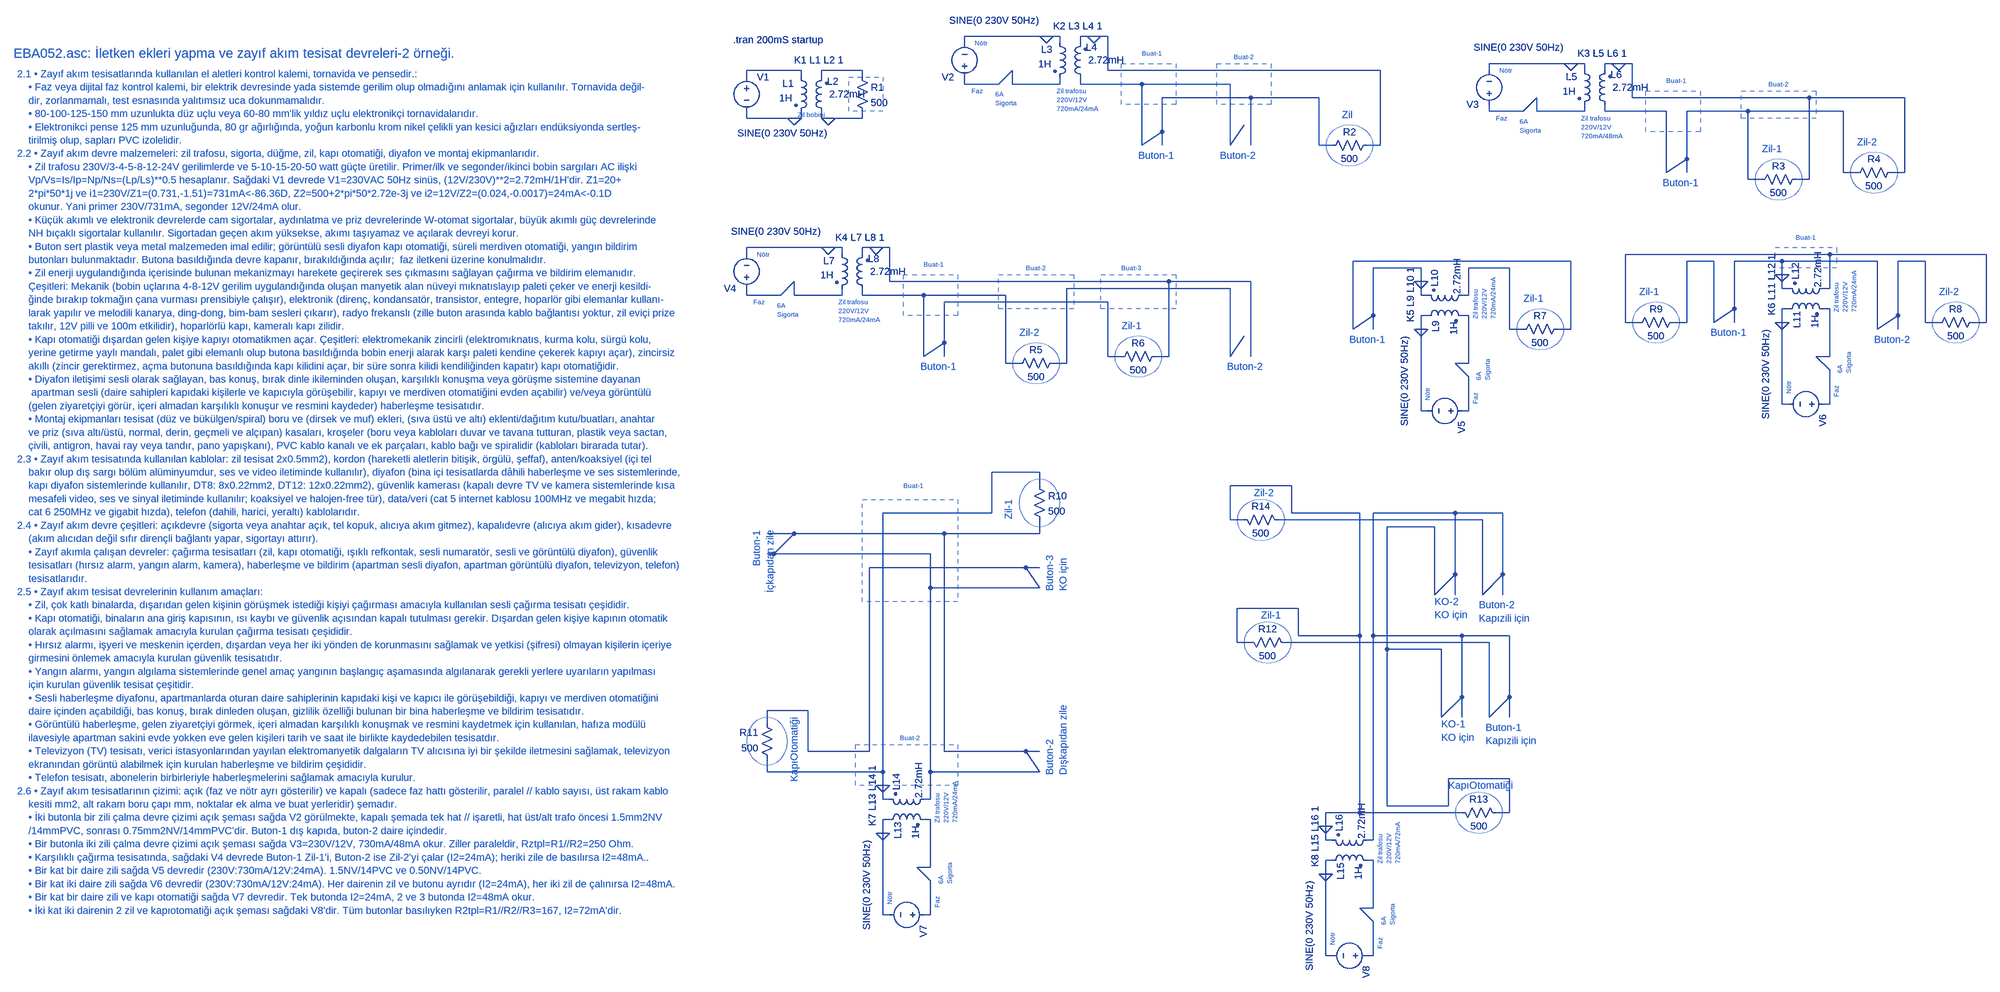
[diagram p0: schematic EBA052.asc]
EBA052.asc, the LTspice schematic file:
Version 4
SHEET 1 6276 2612
WIRE 2512 0 2320 0
WIRE 2544 0 2512 0
WIRE 2624 0 2592 0
WIRE 2656 0 2624 0
WIRE 2320 16 2320 0
WIRE 2544 16 2544 0
WIRE 2592 16 2592 0
WIRE 3744 64 3552 64
WIRE 3776 64 3744 64
WIRE 3856 64 3824 64
WIRE 3888 64 3856 64
WIRE 1936 80 1808 80
WIRE 2080 80 1984 80
WIRE 2656 80 2656 0
WIRE 3296 80 2656 80
WIRE 3552 80 3552 64
WIRE 3776 80 3776 64
WIRE 3824 80 3824 64
WIRE 1808 96 1808 80
WIRE 1936 96 1936 80
WIRE 1984 96 1984 80
WIRE 2080 96 2080 80
WIRE 2320 112 2320 96
WIRE 2400 112 2432 80
WIRE 2400 112 2320 112
WIRE 2432 112 2432 80
WIRE 2544 112 2544 96
WIRE 2544 112 2432 112
WIRE 2592 112 2592 96
WIRE 2736 112 2592 112
WIRE 2944 112 2736 112
WIRE 2992 144 2784 144
WIRE 3152 144 2992 144
WIRE 3888 144 3888 64
WIRE 4304 144 3888 144
WIRE 4528 144 4304 144
WIRE 3552 176 3552 160
WIRE 3632 176 3664 144
WIRE 3632 176 3552 176
WIRE 3664 176 3664 144
WIRE 3776 176 3776 160
WIRE 3776 176 3664 176
WIRE 3824 176 3824 160
WIRE 3968 176 3824 176
WIRE 4160 176 4016 176
WIRE 4384 176 4160 176
WIRE 1808 192 1808 176
WIRE 1920 192 1808 192
WIRE 1936 192 1936 176
WIRE 1936 192 1920 192
WIRE 1984 192 1984 176
WIRE 2000 192 1984 192
WIRE 2080 192 2080 176
WIRE 2080 192 2000 192
WIRE 2784 224 2784 144
WIRE 2736 256 2736 112
WIRE 2736 256 2784 224
WIRE 2784 256 2784 224
WIRE 2944 256 2944 112
WIRE 2944 256 2976 208
WIRE 2992 256 2992 144
WIRE 3152 256 3152 144
WIRE 3184 256 3152 256
WIRE 3296 256 3296 80
WIRE 3296 256 3264 256
WIRE 4016 288 4016 176
WIRE 3968 320 3968 176
WIRE 3968 320 4016 288
WIRE 4016 320 4016 288
WIRE 4384 320 4384 176
WIRE 4416 320 4384 320
WIRE 4528 320 4528 144
WIRE 4528 320 4496 320
WIRE 4160 336 4160 176
WIRE 4192 336 4160 336
WIRE 4304 336 4304 144
WIRE 4304 336 4272 336
WIRE 2000 496 1808 496
WIRE 2032 496 2000 496
WIRE 2112 496 2080 496
WIRE 2144 496 2112 496
WIRE 1808 512 1808 496
WIRE 2032 512 2032 496
WIRE 2080 512 2080 496
WIRE 4352 512 3872 512
WIRE 4720 512 4352 512
WIRE 3744 528 3232 528
WIRE 4080 528 4016 528
WIRE 4240 528 4128 528
WIRE 4464 528 4240 528
WIRE 4576 528 4512 528
WIRE 3392 544 3280 544
WIRE 3600 544 3504 544
WIRE 4240 560 4240 528
WIRE 2144 576 2144 496
WIRE 2800 576 2144 576
WIRE 2992 576 2800 576
WIRE 3392 576 3392 544
WIRE 2944 592 2560 592
WIRE 4240 592 4240 560
WIRE 4256 592 4240 592
WIRE 4352 592 4352 512
WIRE 4352 592 4336 592
WIRE 1808 608 1808 592
WIRE 1888 608 1920 576
WIRE 1888 608 1808 608
WIRE 1920 608 1920 576
WIRE 2032 608 2032 592
WIRE 2032 608 1920 608
WIRE 2080 608 2080 592
WIRE 2224 608 2080 608
WIRE 2416 608 2224 608
WIRE 3392 608 3392 576
WIRE 3408 608 3392 608
WIRE 3504 608 3504 544
WIRE 3504 608 3488 608
WIRE 2656 624 2272 624
WIRE 4128 640 4128 528
WIRE 4256 640 4240 640
WIRE 4352 640 4336 640
WIRE 3280 656 3280 544
WIRE 3408 656 3392 656
WIRE 3504 656 3488 656
WIRE 4512 656 4512 528
WIRE 3872 672 3872 512
WIRE 3904 672 3872 672
WIRE 4016 672 4016 528
WIRE 4016 672 3984 672
WIRE 4080 672 4080 528
WIRE 4080 672 4128 640
WIRE 4128 672 4128 640
WIRE 4240 672 4240 640
WIRE 4576 672 4576 528
WIRE 4608 672 4576 672
WIRE 4720 672 4720 512
WIRE 4720 672 4688 672
WIRE 3232 688 3232 528
WIRE 3232 688 3280 656
WIRE 3280 688 3280 656
WIRE 3392 688 3392 656
WIRE 3600 688 3600 544
WIRE 3632 688 3600 688
WIRE 3744 688 3744 528
WIRE 3744 688 3712 688
WIRE 4464 688 4464 528
WIRE 4464 688 4512 656
WIRE 4512 688 4512 656
WIRE 2272 720 2272 624
WIRE 2224 752 2224 608
WIRE 2224 752 2272 720
WIRE 2272 752 2272 720
WIRE 2656 752 2656 624
WIRE 2688 752 2656 752
WIRE 2800 752 2800 576
WIRE 2800 752 2768 752
WIRE 2944 752 2944 592
WIRE 2944 752 2976 704
WIRE 2992 752 2992 576
WIRE 4352 752 4352 640
WIRE 4352 752 4320 752
WIRE 2416 768 2416 608
WIRE 2448 768 2416 768
WIRE 2560 768 2560 592
WIRE 2560 768 2528 768
WIRE 3504 768 3504 656
WIRE 3504 768 3472 768
WIRE 4352 784 4320 752
WIRE 3504 800 3472 768
WIRE 4240 864 4240 672
WIRE 4256 864 4240 864
WIRE 4352 864 4352 784
WIRE 4352 864 4336 864
WIRE 3392 880 3392 688
WIRE 3408 880 3392 880
WIRE 3504 880 3504 800
WIRE 3504 880 3488 880
WIRE 2496 1024 2384 1024
WIRE 2496 1056 2496 1024
WIRE 3088 1056 2944 1056
WIRE 2384 1120 2384 1024
WIRE 2384 1120 2128 1120
WIRE 3088 1120 3088 1056
WIRE 3248 1120 3088 1120
WIRE 3472 1120 3280 1120
WIRE 3584 1120 3472 1120
WIRE 2944 1136 2944 1056
WIRE 2976 1136 2944 1136
WIRE 3536 1136 3056 1136
WIRE 3424 1152 3312 1152
WIRE 1920 1168 1856 1168
WIRE 2272 1168 1920 1168
WIRE 2496 1168 2496 1136
WIRE 2496 1168 2272 1168
WIRE 1872 1216 1920 1168
WIRE 1872 1216 1856 1216
WIRE 2240 1216 1872 1216
WIRE 2464 1248 2096 1248
WIRE 2496 1248 2464 1248
WIRE 3472 1264 3472 1120
WIRE 3584 1264 3584 1120
WIRE 2240 1296 2240 1216
WIRE 2496 1296 2464 1248
WIRE 2496 1296 2240 1296
WIRE 3424 1312 3424 1152
WIRE 3424 1312 3472 1264
WIRE 3472 1312 3472 1264
WIRE 3536 1312 3536 1136
WIRE 3536 1312 3584 1264
WIRE 3584 1312 3584 1264
WIRE 3104 1344 2960 1344
WIRE 3104 1408 3104 1344
WIRE 3248 1408 3248 1120
WIRE 3248 1408 3104 1408
WIRE 3280 1408 3280 1120
WIRE 3488 1408 3280 1408
WIRE 3600 1408 3488 1408
WIRE 2960 1424 2960 1344
WIRE 2992 1424 2960 1424
WIRE 3552 1424 3072 1424
WIRE 3312 1440 3312 1152
WIRE 3440 1440 3312 1440
WIRE 3488 1552 3488 1408
WIRE 3600 1552 3600 1408
WIRE 1952 1584 1856 1584
WIRE 3440 1600 3440 1440
WIRE 3440 1600 3488 1552
WIRE 3488 1600 3488 1552
WIRE 3552 1600 3552 1424
WIRE 3552 1600 3600 1552
WIRE 3600 1600 3600 1552
WIRE 1856 1616 1856 1584
WIRE 1952 1680 1952 1584
WIRE 2096 1680 2096 1248
WIRE 2096 1680 1952 1680
WIRE 2272 1680 2272 1168
WIRE 2464 1680 2272 1680
WIRE 2496 1680 2464 1680
WIRE 1856 1728 1856 1696
WIRE 2128 1728 2128 1120
WIRE 2128 1728 1856 1728
WIRE 2240 1728 2240 1296
WIRE 2496 1728 2464 1680
WIRE 2496 1728 2240 1728
WIRE 3600 1744 3456 1744
WIRE 2128 1760 2128 1728
WIRE 2128 1792 2128 1760
WIRE 2144 1792 2128 1792
WIRE 2240 1792 2240 1728
WIRE 2240 1792 2224 1792
WIRE 3312 1808 3312 1440
WIRE 3456 1808 3456 1744
WIRE 3456 1808 3312 1808
WIRE 3248 1824 3248 1408
WIRE 3248 1824 3168 1824
WIRE 3488 1824 3248 1824
WIRE 3600 1824 3600 1744
WIRE 3600 1824 3568 1824
WIRE 2144 1840 2128 1840
WIRE 2240 1840 2224 1840
WIRE 3168 1856 3168 1824
WIRE 2128 1872 2128 1840
WIRE 3168 1888 3168 1856
WIRE 3184 1888 3168 1888
WIRE 3280 1888 3280 1408
WIRE 3280 1888 3264 1888
WIRE 3184 1936 3168 1936
WIRE 3280 1936 3264 1936
WIRE 2240 1952 2240 1840
WIRE 2240 1952 2208 1952
WIRE 3168 1968 3168 1936
WIRE 2240 1984 2208 1952
WIRE 3280 2048 3280 1936
WIRE 3280 2048 3248 2048
WIRE 2128 2064 2128 1872
WIRE 2144 2064 2128 2064
WIRE 2240 2064 2240 1984
WIRE 2240 2064 2224 2064
WIRE 3280 2080 3248 2048
WIRE 3168 2160 3168 1968
WIRE 3184 2160 3168 2160
WIRE 3280 2160 3280 2080
WIRE 3280 2160 3264 2160
FLAG 1920 192 0
FLAG 2000 192 0
FLAG 2512 0 0
FLAG 2624 0 0
FLAG 3744 64 0
FLAG 3856 64 0
FLAG 2000 496 0
FLAG 2112 496 0
FLAG 3392 688 0
FLAG 3392 576 0
FLAG 4240 672 0
FLAG 4240 560 0
FLAG 2128 1872 0
FLAG 2128 1760 0
FLAG 3168 1968 0
FLAG 3168 1856 0
SYMBOL voltage 1808 80 R0
WINDOW 3 -22 147 Left 2
WINDOW 123 0 0 Left 0
WINDOW 39 0 0 Left 0
SYMATTR Value SINE(0 230V 50Hz)
SYMATTR InstName V1
SYMBOL ind2 1920 80 R0
WINDOW 0 -28 31 Left 2
WINDOW 3 -35 65 Left 2
SYMATTR InstName L1
SYMATTR Value 1H
SYMATTR Type ind
SYMATTR SpiceLine Rser=20
SYMBOL ind2 2000 192 R180
WINDOW 0 -24 86 Left 2
WINDOW 3 -87 56 Left 2
SYMATTR InstName L2
SYMATTR Value 2.72mH
SYMATTR Type ind
SYMBOL res 2064 80 R0
SYMATTR InstName R1
SYMATTR Value 500
SYMBOL voltage 2320 112 R180
WINDOW 3 -175 150 Left 2
WINDOW 123 0 0 Left 0
WINDOW 39 0 0 Left 0
SYMATTR Value SINE(0 230V 50Hz)
SYMATTR InstName V2
SYMBOL ind2 2528 0 R0
WINDOW 0 -28 31 Left 2
WINDOW 3 -35 65 Left 2
SYMATTR InstName L3
SYMATTR Value 1H
SYMATTR Type ind
SYMATTR SpiceLine Rser=20
SYMBOL ind2 2608 112 R180
WINDOW 0 -24 86 Left 2
WINDOW 3 -87 56 Left 2
SYMATTR InstName L4
SYMATTR Value 2.72mH
SYMATTR Type ind
SYMBOL res 3280 240 R90
WINDOW 0 0 56 VBottom 2
WINDOW 3 32 56 VTop 2
SYMATTR InstName R2
SYMATTR Value 500
SYMBOL voltage 3552 176 R180
WINDOW 3 -175 150 Left 2
WINDOW 123 0 0 Left 0
WINDOW 39 0 0 Left 0
SYMATTR Value SINE(0 230V 50Hz)
SYMATTR InstName V3
SYMBOL ind2 3760 64 R0
WINDOW 0 -28 31 Left 2
WINDOW 3 -35 65 Left 2
SYMATTR InstName L5
SYMATTR Value 1H
SYMATTR Type ind
SYMATTR SpiceLine Rser=20
SYMBOL ind2 3840 176 R180
WINDOW 0 -24 86 Left 2
WINDOW 3 -87 56 Left 2
SYMATTR InstName L6
SYMATTR Value 2.72mH
SYMATTR Type ind
SYMBOL res 4512 304 R90
WINDOW 0 0 56 VBottom 2
WINDOW 3 32 56 VTop 2
SYMATTR InstName R4
SYMATTR Value 500
SYMBOL res 4288 320 R90
WINDOW 0 0 56 VBottom 2
WINDOW 3 32 56 VTop 2
SYMATTR InstName R3
SYMATTR Value 500
SYMBOL voltage 1808 608 R180
WINDOW 3 -175 150 Left 2
WINDOW 123 0 0 Left 0
WINDOW 39 0 0 Left 0
SYMATTR Value SINE(0 230V 50Hz)
SYMATTR InstName V4
SYMBOL ind2 2016 496 R0
WINDOW 0 -28 31 Left 2
WINDOW 3 -35 65 Left 2
SYMATTR InstName L7
SYMATTR Value 1H
SYMATTR Type ind
SYMATTR SpiceLine Rser=20
SYMBOL ind2 2096 608 R180
WINDOW 0 -24 86 Left 2
WINDOW 3 -87 56 Left 2
SYMATTR InstName L8
SYMATTR Value 2.72mH
SYMATTR Type ind
SYMBOL res 2784 736 R90
WINDOW 0 0 56 VBottom 2
WINDOW 3 32 56 VTop 2
SYMATTR InstName R6
SYMATTR Value 500
SYMBOL res 2544 752 R90
WINDOW 0 0 56 VBottom 2
WINDOW 3 32 56 VTop 2
SYMATTR InstName R5
SYMATTR Value 500
SYMBOL voltage 3504 880 R90
WINDOW 3 -175 150 Left 2
WINDOW 123 0 0 Left 0
WINDOW 39 0 0 Left 0
SYMATTR Value SINE(0 230V 50Hz)
SYMATTR InstName V5
SYMBOL ind2 3392 672 R270
WINDOW 0 -10 51 Bottom 2
WINDOW 3 -15 62 Top 2
SYMATTR InstName L9
SYMATTR Value 1H
SYMATTR Type ind
SYMATTR SpiceLine Rser=20
SYMBOL ind2 3504 592 R90
WINDOW 0 -24 64 Top 2
WINDOW 3 -28 43 Bottom 2
SYMATTR InstName L10
SYMATTR Value 2.72mH
SYMATTR Type ind
SYMBOL res 3728 672 R90
WINDOW 0 0 56 VBottom 2
WINDOW 3 32 56 VTop 2
SYMATTR InstName R7
SYMATTR Value 500
SYMBOL voltage 4352 864 R90
WINDOW 3 -175 150 Left 2
WINDOW 123 0 0 Left 0
WINDOW 39 0 0 Left 0
SYMATTR Value SINE(0 230V 50Hz)
SYMATTR InstName V6
SYMBOL ind2 4240 656 R270
WINDOW 0 -10 51 Bottom 2
WINDOW 3 -15 62 Top 2
SYMATTR InstName L11
SYMATTR Value 1H
SYMATTR Type ind
SYMATTR SpiceLine Rser=20
SYMBOL ind2 4352 576 R90
WINDOW 0 -24 64 Top 2
WINDOW 3 -28 43 Bottom 2
SYMATTR InstName L12
SYMATTR Value 2.72mH
SYMATTR Type ind
SYMBOL res 4704 656 R90
WINDOW 0 0 56 VBottom 2
WINDOW 3 32 56 VTop 2
SYMATTR InstName R8
SYMATTR Value 500
SYMBOL res 4000 656 R90
WINDOW 0 0 56 VBottom 2
WINDOW 3 32 56 VTop 2
SYMATTR InstName R9
SYMATTR Value 500
SYMBOL voltage 2240 2064 R90
WINDOW 3 -175 150 Left 2
WINDOW 123 0 0 Left 0
WINDOW 39 0 0 Left 0
SYMATTR Value SINE(0 230V 50Hz)
SYMATTR InstName V7
SYMBOL ind2 2128 1856 R270
WINDOW 0 -10 51 Bottom 2
WINDOW 3 -15 62 Top 2
SYMATTR InstName L13
SYMATTR Value 1H
SYMATTR Type ind
SYMATTR SpiceLine Rser=20
SYMBOL ind2 2240 1776 R90
WINDOW 0 -24 64 Top 2
WINDOW 3 -28 43 Bottom 2
SYMATTR InstName L14
SYMATTR Value 2.72mH
SYMATTR Type ind
SYMBOL res 2480 1040 R0
SYMATTR InstName R10
SYMATTR Value 500
SYMBOL res 1872 1712 R180
WINDOW 0 36 76 Left 2
WINDOW 3 36 40 Left 2
SYMATTR InstName R11
SYMATTR Value 500
SYMBOL voltage 3280 2160 R90
WINDOW 3 -175 150 Left 2
WINDOW 123 0 0 Left 0
WINDOW 39 0 0 Left 0
SYMATTR Value SINE(0 230V 50Hz)
SYMATTR InstName V8
SYMBOL ind2 3168 1952 R270
WINDOW 0 -10 51 Bottom 2
WINDOW 3 -15 62 Top 2
SYMATTR InstName L15
SYMATTR Value 1H
SYMATTR Type ind
SYMATTR SpiceLine Rser=20
SYMBOL ind2 3280 1872 R90
WINDOW 0 -24 64 Top 2
WINDOW 3 -28 43 Bottom 2
SYMATTR InstName L16
SYMATTR Value 2.72mH
SYMATTR Type ind
SYMBOL res 2976 1408 M90
WINDOW 0 0 56 VBottom 2
WINDOW 3 32 56 VTop 2
SYMATTR InstName R12
SYMATTR Value 500
SYMBOL res 3472 1808 M90
WINDOW 0 0 56 VBottom 2
WINDOW 3 32 56 VTop 2
SYMATTR InstName R13
SYMATTR Value 500
SYMBOL res 2960 1120 M90
WINDOW 0 0 56 VBottom 2
WINDOW 3 32 56 VTop 2
SYMATTR InstName R14
SYMATTR Value 500
TEXT -152 40 Left 3 ;EBA052.asc: İletken ekleri yapma ve zayıf akım tesisat devreleri-2 örneği.
TEXT -144 88 Left 2 ;2.1 • Zayıf akım tesisatlarında kullanılan el aletleri kontrol kalemi, tornavida ve pensedir.:\n    • Faz veya dijital faz kontrol kalemi, bir elektrik devresinde yada sistemde gerilim olup olmadığını anlamak için kullanılır. Tornavida değil-\n    dir, zorlanmamalı, test esnasında yalıtımsız uca dokunmamalıdır.\n    • 80-100-125-150 mm uzunlukta düz uçlu veya 60-80 mm'lik yıldız uçlu elektronikçi tornavidalarıdır.\n    • Elektronikci pense 125 mm uzunluğunda, 80 gr ağırlığında, yoğun karbonlu krom nikel çelikli yan kesici ağızları endüksiyonda sertleş-\n    tirilmiş olup, sapları PVC izolelidir.\n2.2 • Zayıf akım devre malzemeleri: zil trafosu, sigorta, düğme, zil, kapı otomatiği, diyafon ve montaj ekipmanlarıdır.\n    • Zil trafosu 230V/3-4-5-8-12-24V gerilimlerde ve 5-10-15-20-50 watt güçte üretilir. Primer/ilk ve segonder/ikinci bobin sargıları AC ilişki\n    Vp/Vs=Is/Ip=Np/Ns=(Lp/Ls)**0.5 hesaplanır. Sağdaki V1 devrede V1=230VAC 50Hz sinüs, (12V/230V)**2=2.72mH/1H'dir. Z1=20+\n    2*pi*50*1j ve i1=230V/Z1=(0.731,-1.51)=731mA<-86.36D, Z2=500+2*pi*50*2.72e-3j ve i2=12V/Z2=(0.024,-0.0017)=24mA<-0.1D\n    okunur. Yani primer 230V/731mA, segonder 12V/24mA olur.\n    • Küçük akımlı ve elektronik devrelerde cam sigortalar, aydınlatma ve priz devrelerinde W-otomat sigortalar, büyük akımlı güç devrelerinde\n    NH bıçaklı sigortalar kullanılır. Sigortadan geçen akım yüksekse, akımı taşıyamaz ve açılarak devreyi korur.\n    • Buton sert plastik veya metal malzemeden imal edilir; görüntülü sesli diyafon kapı otomatiği, süreli merdiven otomatiği, yangın bildirim\n    butonları bulunmaktadır. Butona basıldığında devre kapanır, bırakıldığında açılır;  faz iletkeni üzerine konulmalıdır.\n    • Zil enerji uygulandığında içerisinde bulunan mekanizmayı harekete geçirerek ses çıkmasını sağlayan çağırma ve bildirim elemanıdır. \n    Çeşitleri: Mekanik (bobin uçlarına 4-8-12V gerilim uygulandığında oluşan manyetik alan nüveyi mıknatıslayıp paleti çeker ve enerji kesildi-\n    ğinde bırakıp tokmağın çana vurması prensibiyle çalışır), elektronik (direnç, kondansatör, transistor, entegre, hoparlör gibi elemanlar kullanı-\n    larak yapılır ve melodili kanarya, ding-dong, bim-bam sesleri çıkarır), radyo frekanslı (zille buton arasında kablo bağlantısı yoktur, zil eviçi prize\n    takılır, 12V pilli ve 100m etkilidir), hoparlörlü kapı, kameralı kapı zilidir.\n    • Kapı otomatiği dışardan gelen kişiye kapıyı otomatikmen açar. Çeşitleri: elektromekanik zincirli (elektromıknatıs, kurma kolu, sürgü kolu, \n    yerine getirme yaylı mandalı, palet gibi elemanlı olup butona basıldığında bobin enerji alarak karşı paleti kendine çekerek kapıyı açar), zincirsiz\n    akıllı (zincir gerektirmez, açma butonuna basıldığında kapı kilidini açar, bir süre sonra kilidi kendiliğinden kapatır) kapı otomatiğidir.\n    • Diyafon iletişimi sesli olarak sağlayan, bas konuş, bırak dinle ikileminden oluşan, karşılıklı konuşma veya görüşme sistemine dayanan\n     apartman sesli (daire sahipleri kapıdaki kişilerle ve kapıcıyla görüşebilir, kapıyı ve merdiven otomatiğini evden açabilir) ve/veya görüntülü \n    (gelen ziyaretçiyi görür, içeri almadan karşılıklı konuşur ve resmini kaydeder) haberleşme tesisatıdır.\n    • Montaj ekipmanları tesisat (düz ve bükülgen/spiral) boru ve (dirsek ve muf) ekleri, (sıva üstü ve altı) eklenti/dağıtım kutu/buatları, anahtar\n    ve priz (sıva altı/üstü, normal, derin, geçmeli ve alçıpan) kasaları, kroşeler (boru veya kabloları duvar ve tavana tutturan, plastik veya sactan,\n    çivili, antigron, havai ray veya tandır, pano yapışkanı), PVC kablo kanalı ve ek parçaları, kablo bağı ve spiralidir (kabloları birarada tutar).\n2.3 • Zayıf akım tesisatında kullanılan kablolar: zil tesisat 2x0.5mm2), kordon (hareketli aletlerin bitişik, örgülü, şeffaf), anten/koaksiyel (içi tel \n    bakır olup dış sargı bölüm alüminyumdur, ses ve video iletiminde kullanılır), diyafon (bina içi tesisatlarda dâhili haberleşme ve ses sistemlerinde, \n    kapı diyafon sistemlerinde kullanılır, DT8: 8x0.22mm2, DT12: 12x0.22mm2), güvenlik kamerası (kapalı devre TV ve kamera sistemlerinde kısa\n    mesafeli video, ses ve sinyal iletiminde kullanılır; koaksiyel ve halojen-free tür), data/veri (cat 5 internet kablosu 100MHz ve megabit hızda; \n    cat 6 250MHz ve gigabit hızda), telefon (dahili, harici, yeraltı) kablolarıdır.\n2.4 • Zayıf akım devre çeşitleri: açıkdevre (sigorta veya anahtar açık, tel kopuk, alıcıya akım gitmez), kapalıdevre (alıcıya akım gider), kısadevre\n    (akım alıcıdan değil sıfır dirençli bağlantı yapar, sigortayı attırır).\n    • Zayıf akımla çalışan devreler: çağırma tesisatları (zil, kapı otomatiği, ışıklı refkontak, sesli numaratör, sesli ve görüntülü diyafon), güvenlik \n    tesisatları (hırsız alarm, yangın alarm, kamera), haberleşme ve bildirim (apartman sesli diyafon, apartman görüntülü diyafon, televizyon, telefon)\n    tesisatlarıdır.\n2.5 • Zayıf akım tesisat devrelerinin kullanım amaçları:\n    • Zil, çok katlı binalarda, dışarıdan gelen kişinin görüşmek istediği kişiyi çağırması amacıyla kullanılan sesli çağırma tesisatı çeşididir.\n    • Kapı otomatiği, binaların ana giriş kapısının, ısı kaybı ve güvenlik açısından kapalı tutulması gerekir. Dışardan gelen kişiye kapının otomatik\n    olarak açılmasını sağlamak amacıyla kurulan çağırma tesisatı çeşididir.\n    • Hırsız alarmı, işyeri ve meskenin içerden, dışardan veya her iki yönden de korunmasını sağlamak ve yetkisi (şifresi) olmayan kişilerin içeriye \n    girmesini önlemek amacıyla kurulan güvenlik tesisatıdır.\n    • Yangın alarmı, yangın algılama sistemlerinde genel amaç yangının başlangıç aşamasında algılanarak gerekli yerlere uyarıların yapılması \n    için kurulan güvenlik tesisat çeşitidir.\n    • Sesli haberleşme diyafonu, apartmanlarda oturan daire sahiplerinin kapıdaki kişi ve kapıcı ile görüşebildiği, kapıyı ve merdiven otomatiğini \n    daire içinden açabildiği, bas konuş, bırak dinleden oluşan, gizlilik özelliği bulunan bir bina haberleşme ve bildirim tesisatıdır.\n    • Görüntülü haberleşme, gelen ziyaretçiyi görmek, içeri almadan karşılıklı konuşmak ve resmini kaydetmek için kullanılan, hafıza modülü\n    ilavesiyle apartman sakini evde yokken eve gelen kişileri tarih ve saat ile birlikte kaydedebilen tesisatdır.\n    • Televizyon (TV) tesisatı, verici istasyonlarından yayılan elektromanyetik dalgaların TV alıcısına iyi bir şekilde iletmesini sağlamak, televizyon\n    ekranından görüntü alabilmek için kurulan haberleşme ve bildirim çeşididir.\n    • Telefon tesisatı, abonelerin birbirleriyle haberleşmelerini sağlamak amacıyla kurulur.\n2.6 • Zayıf akım tesisatlarının çizimi: açık (faz ve nötr ayrı gösterilir) ve kapalı (sadece faz hattı gösterilir, paralel // kablo sayısı, üst rakam kablo\n    kesiti mm2, alt rakam boru çapı mm, noktalar ek alma ve buat yerleridir) şemadır.\n    • İki butonla bir zili çalma devre çizimi açık şeması sağda V2 görülmekte, kapalı şemada tek hat // işaretli, hat üst/alt trafo öncesi 1.5mm2NV\n    /14mmPVC, sonrası 0.75mm2NV/14mmPVC'dir. Buton-1 dış kapıda, buton-2 daire içindedir.\n    • Bir butonla iki zili çalma devre çizimi açık şeması sağda V3=230V/12V, 730mA/48mA okur. Ziller paraleldir, Rztpl=R1//R2=250 Ohm.\n    • Karşılıklı çağırma tesisatında, sağdaki V4 devrede Buton-1 Zil-1'i, Buton-2 ise Zil-2'yi çalar (I2=24mA); heriki zile de basılırsa I2=48mA..\n    • Bir kat bir daire zili sağda V5 devredir (230V:730mA/12V:24mA). 1.5NV/14PVC ve 0.50NV/14PVC.\n    • Bir kat iki daire zili sağda V6 devredir (230V:730mA/12V:24mA). Her dairenin zil ve butonu ayrıdır (I2=24mA), her iki zil de çalınırsa I2=48mA.\n    • Bir kat bir daire zili ve kapı otomatiği sağda V7 devredir. Tek butonda I2=24mA, 2 ve 3 butonda I2=48mA okur.\n    • İki kat iki dairenin 2 zil ve kapıotomatiği açık şeması sağdaki V8'dir. Tüm butonlar basılıyken R2tpl=R1//R2//R3=167, I2=72mA'dir.
TEXT 1920 56 Left 2 !K1 L1 L2 1
TEXT 1928 184 Left 1 ;Zil bobini
TEXT 1776 8 Left 2 !.tran 200mS startup
TEXT 2528 -24 Left 2 !K2 L3 L4 1
TEXT 2536 128 Left 1 ;Zil trafosu\n220V/12V\n720mA/24mA
TEXT 2392 136 Left 1 ;6A\nSigorta
TEXT 3232 184 Right 2 ;Zil
TEXT 2736 40 Left 1 ;Buat-1
TEXT 2952 48 Left 1 ;Buat-2
TEXT 2728 280 Left 2 ;Buton-1
TEXT 2920 280 Left 2 ;Buton-2
TEXT 2336 128 Left 1 ;Faz
TEXT 2344 16 Left 1 ;Nötr
TEXT 3760 40 Left 2 !K3 L5 L6 1
TEXT 3768 192 Left 1 ;Zil trafosu\n220V/12V\n720mA/48mA
TEXT 3624 200 Left 1 ;6A\nSigorta
TEXT 4464 248 Right 2 ;Zil-2
TEXT 3968 104 Left 1 ;Buat-1
TEXT 3960 344 Left 2 ;Buton-1
TEXT 3568 192 Left 1 ;Faz
TEXT 3576 80 Left 1 ;Nötr
TEXT 4240 264 Right 2 ;Zil-1
TEXT 4208 112 Left 1 ;Buat-2
TEXT 2016 472 Left 2 !K4 L7 L8 1
TEXT 2024 624 Left 1 ;Zil trafosu\n220V/12V\n720mA/24mA
TEXT 1880 632 Left 1 ;6A\nSigorta
TEXT 2736 680 Right 2 ;Zil-1
TEXT 2224 536 Left 1 ;Buat-1
TEXT 2216 776 Left 2 ;Buton-1
TEXT 1824 624 Left 1 ;Faz
TEXT 1832 512 Left 1 ;Nötr
TEXT 2496 696 Right 2 ;Zil-2
TEXT 2464 544 Left 1 ;Buat-2
TEXT 2936 776 Left 2 ;Buton-2
TEXT 2688 544 Left 1 ;Buat-3
TEXT 3368 672 VLeft 2 !K5 L9 L10 1
TEXT 3520 664 VLeft 1 ;Zil trafosu\n220V/12V\n720mA/24mA
TEXT 3528 808 VLeft 1 ;6A\nSigorta
TEXT 3224 712 Left 2 ;Buton-1
TEXT 3520 864 VLeft 1 ;Faz
TEXT 3408 856 VLeft 1 ;Nötr
TEXT 3680 616 Right 2 ;Zil-1
TEXT 4216 656 VLeft 2 !K6 L11 L12 1
TEXT 4368 648 VLeft 1 ;Zil trafosu\n220V/12V\n720mA/24mA
TEXT 4376 792 VLeft 1 ;6A\nSigorta
TEXT 4072 696 Left 2 ;Buton-1
TEXT 4368 848 VLeft 1 ;Faz
TEXT 4256 840 VLeft 1 ;Nötr
TEXT 4656 600 Right 2 ;Zil-2
TEXT 4456 712 Left 2 ;Buton-2
TEXT 3952 600 Right 2 ;Zil-1
TEXT 4272 472 Left 1 ;Buat-1
TEXT 2104 1856 VLeft 2 !K7 L13 L14 1
TEXT 2256 1848 VLeft 1 ;Zil trafosu\n220V/12V\n720mA/24mA
TEXT 2264 1992 VLeft 1 ;6A\nSigorta
TEXT 1832 1160 VRight 2 ;Buton-1\nİçkapıdan zile
TEXT 2256 2048 VLeft 1 ;Faz
TEXT 2144 2040 VLeft 1 ;Nötr
TEXT 2424 1088 VRight 2 ;Zil-1
TEXT 1920 1752 VLeft 2 ;KapıOtomatiği
TEXT 2520 1736 VLeft 2 ;Buton-2\nDışkapıdan zile
TEXT 2520 1304 VLeft 2 ;Buton-3\nKO için
TEXT 2176 1056 Left 1 ;Buat-1
TEXT 2168 1648 Left 1 ;Buat-2
TEXT 3144 1952 VLeft 2 !K8 L15 L16 1
TEXT 3296 1944 VLeft 1 ;Zil trafosu\n220V/12V\n720mA/72mA
TEXT 3304 2088 VLeft 1 ;6A\nSigorta
TEXT 3440 1616 Left 2 ;KO-1\nKO için
TEXT 3296 2144 VLeft 1 ;Faz
TEXT 3184 2136 VLeft 1 ;Nötr
TEXT 3016 1360 Left 2 ;Zil-1
TEXT 3456 1760 Left 2 ;KapıOtomatiği
TEXT 3544 1624 Left 2 ;Buton-1\nKapızili için
TEXT 3424 1328 Left 2 ;KO-2\nKO için
TEXT 3000 1072 Left 2 ;Zil-2
TEXT 3528 1336 Left 2 ;Buton-2\nKapızili için
RECTANGLE Normal 2128 176 2048 96 2
RECTANGLE Normal 2816 160 2688 64 2
RECTANGLE Normal 3040 160 2912 64 2
RECTANGLE Normal 4048 224 3920 128 2
RECTANGLE Normal 4320 192 4144 128 2
RECTANGLE Normal 2304 656 2176 560 2
RECTANGLE Normal 2576 640 2400 560 2
RECTANGLE Normal 2816 640 2640 560 2
RECTANGLE Normal 4368 544 4224 496 2
RECTANGLE Normal 2080 1088 2304 1328 2
RECTANGLE Normal 2304 1760 2064 1664 2
ARC Normal 3280 208 3168 304 3169 300 3169 300 2
ARC Normal 4512 272 4400 368 4401 364 4401 364 2
ARC Normal 4288 288 4176 384 4177 380 4177 380 2
ARC Normal 2784 704 2672 800 2673 796 2673 796 2
ARC Normal 2544 720 2432 816 2433 812 2433 812 2
ARC Normal 3728 640 3616 736 3617 732 3617 732 2
ARC Normal 4704 624 4592 720 4593 716 4593 716 2
ARC Normal 4000 624 3888 720 3889 716 3889 716 2
ARC Normal 2448 1040 2544 1152 2540 1151 2540 1151 2
ARC Normal 1904 1712 1808 1600 1812 1601 1812 1601 2
ARC Normal 2976 1376 3088 1472 3087 1468 3087 1468 2
ARC Normal 3472 1776 3584 1872 3583 1868 3583 1868 2
ARC Normal 2960 1088 3072 1184 3071 1180 3071 1180 2

The netlist it stands for:
* EBA052.asc
V1 N001 0 SINE(0 230V 50Hz)
L1 N001 0 1H Rser=20
L2 0 N002 2.72mH
R1 N002 0 500
V2 N003 0 SINE(0 230V 50Hz)
L3 0 N003 1H Rser=20
L4 N004 0 2.72mH
R2 0 N004 500
V3 N005 0 SINE(0 230V 50Hz)
L5 0 N005 1H Rser=20
L6 N006 0 2.72mH
R4 0 N006 500
R3 0 N006 500
V4 N010 0 SINE(0 230V 50Hz)
L7 0 N010 1H Rser=20
L8 N011 0 2.72mH
R6 0 N011 500
R5 N009 N011 500
V5 N013 0 SINE(0 230V 50Hz)
L9 0 N013 1H Rser=20
L10 N008 0 2.72mH
R7 0 N008 500
V6 N012 0 SINE(0 230V 50Hz)
L11 0 N012 1H Rser=20
L12 N007 0 2.72mH
R8 N007 0 500
R9 0 N007 500
V7 N016 0 SINE(0 230V 50Hz)
L13 0 N016 1H Rser=20
L14 N015 0 2.72mH
R10 0 N015 500
R11 0 N015 500
V8 N017 0 SINE(0 230V 50Hz)
L15 0 N017 1H Rser=20
L16 N014 0 2.72mH
R12 0 N014 500
R13 0 N014 500
R14 0 N014 500
* EBA052.asc: İletken ekleri yapma ve zayıf akım tesisat devreleri-2 örneği.
* 2.1 • Zayıf akım tesisatlarında kullanılan el aletleri kontrol kalemi, tornavida ve pensedir.:
*     • Faz veya dijital faz kontrol kalemi, bir elektrik devresinde yada sistemde gerilim olup olmadığını anlamak için kullanılır. Tornavida değil-
*     dir, zorlanmamalı, test esnasında yalıtımsız uca dokunmamalıdır.
*     • 80-100-125-150 mm uzunlukta düz uçlu veya 60-80 mm'lik yıldız uçlu elektronikçi tornavidalarıdır.
*     • Elektronikci pense 125 mm uzunluğunda, 80 gr ağırlığında, yoğun karbonlu krom nikel çelikli yan kesici ağızları endüksiyonda sertleş-
*     tirilmiş olup, sapları PVC izolelidir.
* 2.2 • Zayıf akım devre malzemeleri: zil trafosu, sigorta, düğme, zil, kapı otomatiği, diyafon ve montaj ekipmanlarıdır.
*     • Zil trafosu 230V/3-4-5-8-12-24V gerilimlerde ve 5-10-15-20-50 watt güçte üretilir. Primer/ilk ve segonder/ikinci bobin sargıları AC ilişki
*     Vp/Vs=Is/Ip=Np/Ns=(Lp/Ls)**0.5 hesaplanır. Sağdaki V1 devrede V1=230VAC 50Hz sinüs, (12V/230V)**2=2.72mH/1H'dir. Z1=20+
*     2*pi*50*1j ve i1=230V/Z1=(0.731,-1.51)=731mA<-86.36D, Z2=500+2*pi*50*2.72e-3j ve i2=12V/Z2=(0.024,-0.0017)=24mA<-0.1D
*     okunur. Yani primer 230V/731mA, segonder 12V/24mA olur.
*     • Küçük akımlı ve elektronik devrelerde cam sigortalar, aydınlatma ve priz devrelerinde W-otomat sigortalar, büyük akımlı güç devrelerinde
*     NH bıçaklı sigortalar kullanılır. Sigortadan geçen akım yüksekse, akımı taşıyamaz ve açılarak devreyi korur.
*     • Buton sert plastik veya metal malzemeden imal edilir; görüntülü sesli diyafon kapı otomatiği, süreli merdiven otomatiği, yangın bildirim
*     butonları bulunmaktadır. Butona basıldığında devre kapanır, bırakıldığında açılır;  faz iletkeni üzerine konulmalıdır.
*     • Zil enerji uygulandığında içerisinde bulunan mekanizmayı harekete geçirerek ses çıkmasını sağlayan çağırma ve bildirim elemanıdır.
*     Çeşitleri: Mekanik (bobin uçlarına 4-8-12V gerilim uygulandığında oluşan manyetik alan nüveyi mıknatıslayıp paleti çeker ve enerji kesildi-
*     ğinde bırakıp tokmağın çana vurması prensibiyle çalışır), elektronik (direnç, kondansatör, transistor, entegre, hoparlör gibi elemanlar kullanı-
*     larak yapılır ve melodili kanarya, ding-dong, bim-bam sesleri çıkarır), radyo frekanslı (zille buton arasında kablo bağlantısı yoktur, zil eviçi prize
*     takılır, 12V pilli ve 100m etkilidir), hoparlörlü kapı, kameralı kapı zilidir.
*     • Kapı otomatiği dışardan gelen kişiye kapıyı otomatikmen açar. Çeşitleri: elektromekanik zincirli (elektromıknatıs, kurma kolu, sürgü kolu,
*     yerine getirme yaylı mandalı, palet gibi elemanlı olup butona basıldığında bobin enerji alarak karşı paleti kendine çekerek kapıyı açar), zincirsiz
*     akıllı (zincir gerektirmez, açma butonuna basıldığında kapı kilidini açar, bir süre sonra kilidi kendiliğinden kapatır) kapı otomatiğidir.
*     • Diyafon iletişimi sesli olarak sağlayan, bas konuş, bırak dinle ikileminden oluşan, karşılıklı konuşma veya görüşme sistemine dayanan
*      apartman sesli (daire sahipleri kapıdaki kişilerle ve kapıcıyla görüşebilir, kapıyı ve merdiven otomatiğini evden açabilir) ve/veya görüntülü
*     (gelen ziyaretçiyi görür, içeri almadan karşılıklı konuşur ve resmini kaydeder) haberleşme tesisatıdır.
*     • Montaj ekipmanları tesisat (düz ve bükülgen/spiral) boru ve (dirsek ve muf) ekleri, (sıva üstü ve altı) eklenti/dağıtım kutu/buatları, anahtar
*     ve priz (sıva altı/üstü, normal, derin, geçmeli ve alçıpan) kasaları, kroşeler (boru veya kabloları duvar ve tavana tutturan, plastik veya sactan,
*     çivili, antigron, havai ray veya tandır, pano yapışkanı), PVC kablo kanalı ve ek parçaları, kablo bağı ve spiralidir (kabloları birarada tutar).
* 2.3 • Zayıf akım tesisatında kullanılan kablolar: zil tesisat 2x0.5mm2), kordon (hareketli aletlerin bitişik, örgülü, şeffaf), anten/koaksiyel (içi tel
*     bakır olup dış sargı bölüm alüminyumdur, ses ve video iletiminde kullanılır), diyafon (bina içi tesisatlarda dâhili haberleşme ve ses sistemlerinde,
*     kapı diyafon sistemlerinde kullanılır, DT8: 8x0.22mm2, DT12: 12x0.22mm2), güvenlik kamerası (kapalı devre TV ve kamera sistemlerinde kısa
*     mesafeli video, ses ve sinyal iletiminde kullanılır; koaksiyel ve halojen-free tür), data/veri (cat 5 internet kablosu 100MHz ve megabit hızda;
*     cat 6 250MHz ve gigabit hızda), telefon (dahili, harici, yeraltı) kablolarıdır.
* 2.4 • Zayıf akım devre çeşitleri: açıkdevre (sigorta veya anahtar açık, tel kopuk, alıcıya akım gitmez), kapalıdevre (alıcıya akım gider), kısadevre
*     (akım alıcıdan değil sıfır dirençli bağlantı yapar, sigortayı attırır).
*     • Zayıf akımla çalışan devreler: çağırma tesisatları (zil, kapı otomatiği, ışıklı refkontak, sesli numaratör, sesli ve görüntülü diyafon), güvenlik
*     tesisatları (hırsız alarm, yangın alarm, kamera), haberleşme ve bildirim (apartman sesli diyafon, apartman görüntülü diyafon, televizyon, telefon)
*     tesisatlarıdır.
* 2.5 • Zayıf akım tesisat devrelerinin kullanım amaçları:
*     • Zil, çok katlı binalarda, dışarıdan gelen kişinin görüşmek istediği kişiyi çağırması amacıyla kullanılan sesli çağırma tesisatı çeşididir.
*     • Kapı otomatiği, binaların ana giriş kapısının, ısı kaybı ve güvenlik açısından kapalı tutulması gerekir. Dışardan gelen kişiye kapının otomatik
*     olarak açılmasını sağlamak amacıyla kurulan çağırma tesisatı çeşididir.
*     • Hırsız alarmı, işyeri ve meskenin içerden, dışardan veya her iki yönden de korunmasını sağlamak ve yetkisi (şifresi) olmayan kişilerin içeriye
*     girmesini önlemek amacıyla kurulan güvenlik tesisatıdır.
*     • Yangın alarmı, yangın algılama sistemlerinde genel amaç yangının başlangıç aşamasında algılanarak gerekli yerlere uyarıların yapılması
*     için kurulan güvenlik tesisat çeşitidir.
*     • Sesli haberleşme diyafonu, apartmanlarda oturan daire sahiplerinin kapıdaki kişi ve kapıcı ile görüşebildiği, kapıyı ve merdiven otomatiğini
*     daire içinden açabildiği, bas konuş, bırak dinleden oluşan, gizlilik özelliği bulunan bir bina haberleşme ve bildirim tesisatıdır.
*     • Görüntülü haberleşme, gelen ziyaretçiyi görmek, içeri almadan karşılıklı konuşmak ve resmini kaydetmek için kullanılan, hafıza modülü
*     ilavesiyle apartman sakini evde yokken eve gelen kişileri tarih ve saat ile birlikte kaydedebilen tesisatdır.
*     • Televizyon (TV) tesisatı, verici istasyonlarından yayılan elektromanyetik dalgaların TV alıcısına iyi bir şekilde iletmesini sağlamak, televizyon
*     ekranından görüntü alabilmek için kurulan haberleşme ve bildirim çeşididir.
*     • Telefon tesisatı, abonelerin birbirleriyle haberleşmelerini sağlamak amacıyla kurulur.
* 2.6 • Zayıf akım tesisatlarının çizimi: açık (faz ve nötr ayrı gösterilir) ve kapalı (sadece faz hattı gösterilir, paralel // kablo sayısı, üst rakam kablo
*     kesiti mm2, alt rakam boru çapı mm, noktalar ek alma ve buat yerleridir) şemadır.
*     • İki butonla bir zili çalma devre çizimi açık şeması sağda V2 görülmekte, kapalı şemada tek hat // işaretli, hat üst/alt trafo öncesi 1.5mm2NV
*     /14mmPVC, sonrası 0.75mm2NV/14mmPVC'dir. Buton-1 dış kapıda, buton-2 daire içindedir.
*     • Bir butonla iki zili çalma devre çizimi açık şeması sağda V3=230V/12V, 730mA/48mA okur. Ziller paraleldir, Rztpl=R1//R2=250 Ohm.
*     • Karşılıklı çağırma tesisatında, sağdaki V4 devrede Buton-1 Zil-1'i, Buton-2 ise Zil-2'yi çalar (I2=24mA); heriki zile de basılırsa I2=48mA..
*     • Bir kat bir daire zili sağda V5 devredir (230V:730mA/12V:24mA). 1.5NV/14PVC ve 0.50NV/14PVC.
*     • Bir kat iki daire zili sağda V6 devredir (230V:730mA/12V:24mA). Her dairenin zil ve butonu ayrıdır (I2=24mA), her iki zil de çalınırsa I2=48mA.
*     • Bir kat bir daire zili ve kapı otomatiği sağda V7 devredir. Tek butonda I2=24mA, 2 ve 3 butonda I2=48mA okur.
*     • İki kat iki dairenin 2 zil ve kapıotomatiği açık şeması sağdaki V8'dir. Tüm butonlar basılıyken R2tpl=R1//R2//R3=167, I2=72mA'dir.
K1 L1 L2 1
* Zil bobini
.tran 200mS startup
K2 L3 L4 1
* Zil trafosu
* 220V/12V
* 720mA/24mA
* 6A
* Sigorta
* Zil
* Buat-1
* Buat-2
* Buton-1
* Buton-2
* Faz
* Nötr
K3 L5 L6 1
* Zil trafosu
* 220V/12V
* 720mA/48mA
* 6A
* Sigorta
* Zil-2
* Buat-1
* Buton-1
* Faz
* Nötr
* Zil-1
* Buat-2
K4 L7 L8 1
* Zil trafosu
* 220V/12V
* 720mA/24mA
* 6A
* Sigorta
* Zil-1
* Buat-1
* Buton-1
* Faz
* Nötr
* Zil-2
* Buat-2
* Buton-2
* Buat-3
K5 L9 L10 1
* Zil trafosu
* 220V/12V
* 720mA/24mA
* 6A
* Sigorta
* Buton-1
* Faz
* Nötr
* Zil-1
K6 L11 L12 1
* Zil trafosu
* 220V/12V
* 720mA/24mA
* 6A
* Sigorta
* Buton-1
* Faz
* Nötr
* Zil-2
* Buton-2
* Zil-1
* Buat-1
K7 L13 L14 1
* Zil trafosu
* 220V/12V
* 720mA/24mA
* 6A
* Sigorta
* Buton-1
* İçkapıdan zile
* Faz
* Nötr
* Zil-1
* KapıOtomatiği
* Buton-2
* Dışkapıdan zile
* Buton-3
* KO için
* Buat-1
* Buat-2
K8 L15 L16 1
* Zil trafosu
* 220V/12V
* 720mA/72mA
* 6A
* Sigorta
* KO-1
* KO için
* Faz
* Nötr
* Zil-1
* KapıOtomatiği
* Buton-1
* Kapızili için
* KO-2
* KO için
* Zil-2
* Buton-2
* Kapızili için
.backanno
.end